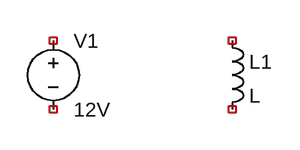
[diagram p0: schematic buck_12V_5V.asc]
buck_12V_5V.asc, the LTspice schematic file:
Version 4.1
SHEET 1 880 680
SYMBOL voltage 0 80 R0
WINDOW 123 0 0 Left 0
WINDOW 39 0 0 Left 0
SYMATTR InstName V1
SYMATTR Value 12V
SYMBOL ind 192 80 R0
SYMATTR InstName L1

The netlist it stands for:
* buck_12V_5V.asc
V1 NC_01 NC_02 12V
L1 NC_03 NC_04 L
.backanno
.end